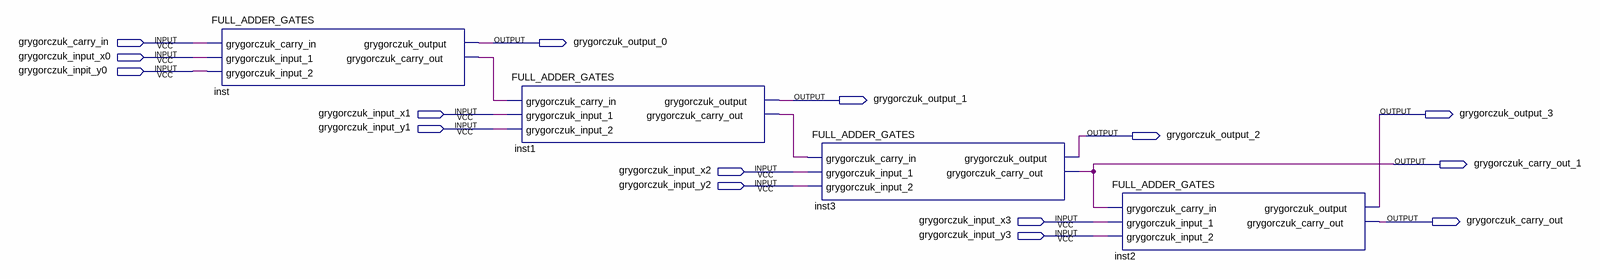
[diagram p0: schematic sheet]
// Quartus schematic FOUR_BIT_ADDER_GATES.bdf as structural Verilog: 4 symbols, 15 pins
module FOUR_BIT_ADDER_GATES (
  input  grygorczuk_carry_in,
  input  grygorczuk_input_x0,
  input  grygorczuk_inpit_y0,
  input  grygorczuk_input_x1,
  input  grygorczuk_input_y1,
  input  grygorczuk_input_x2,
  input  grygorczuk_input_y2,
  input  grygorczuk_input_x3,
  input  grygorczuk_input_y3,
  output grygorczuk_output_0,
  output grygorczuk_output_1,
  output grygorczuk_output_3,
  output grygorczuk_output_2,
  output grygorczuk_carry_out_1,
  output grygorczuk_carry_out
);

  wire inst1_grygorczuk_carry_out, inst_grygorczuk_carry_out;

  FULL_ADDER_GATES inst (
    .grygorczuk_carry_in(grygorczuk_carry_in), .grygorczuk_input_1(grygorczuk_input_x0),
    .grygorczuk_input_2(grygorczuk_inpit_y0), .grygorczuk_output(grygorczuk_output_0),
    .grygorczuk_carry_out(inst_grygorczuk_carry_out));
  FULL_ADDER_GATES inst1 (
    .grygorczuk_carry_in(inst_grygorczuk_carry_out), .grygorczuk_input_1(grygorczuk_input_x1),
    .grygorczuk_input_2(grygorczuk_input_y1), .grygorczuk_output(grygorczuk_output_1),
    .grygorczuk_carry_out(inst1_grygorczuk_carry_out));
  FULL_ADDER_GATES inst3 (
    .grygorczuk_carry_in(inst1_grygorczuk_carry_out), .grygorczuk_input_1(grygorczuk_input_x2),
    .grygorczuk_input_2(grygorczuk_input_y2), .grygorczuk_output(grygorczuk_output_2),
    .grygorczuk_carry_out(grygorczuk_carry_out_1));
  FULL_ADDER_GATES inst2 (
    .grygorczuk_carry_in(grygorczuk_carry_out_1), .grygorczuk_input_1(grygorczuk_input_x3),
    .grygorczuk_input_2(grygorczuk_input_y3), .grygorczuk_output(grygorczuk_output_3),
    .grygorczuk_carry_out(grygorczuk_carry_out));
endmodule
